# Altium schematic sheet main.SchDoc (part 1 of 2)
size A4
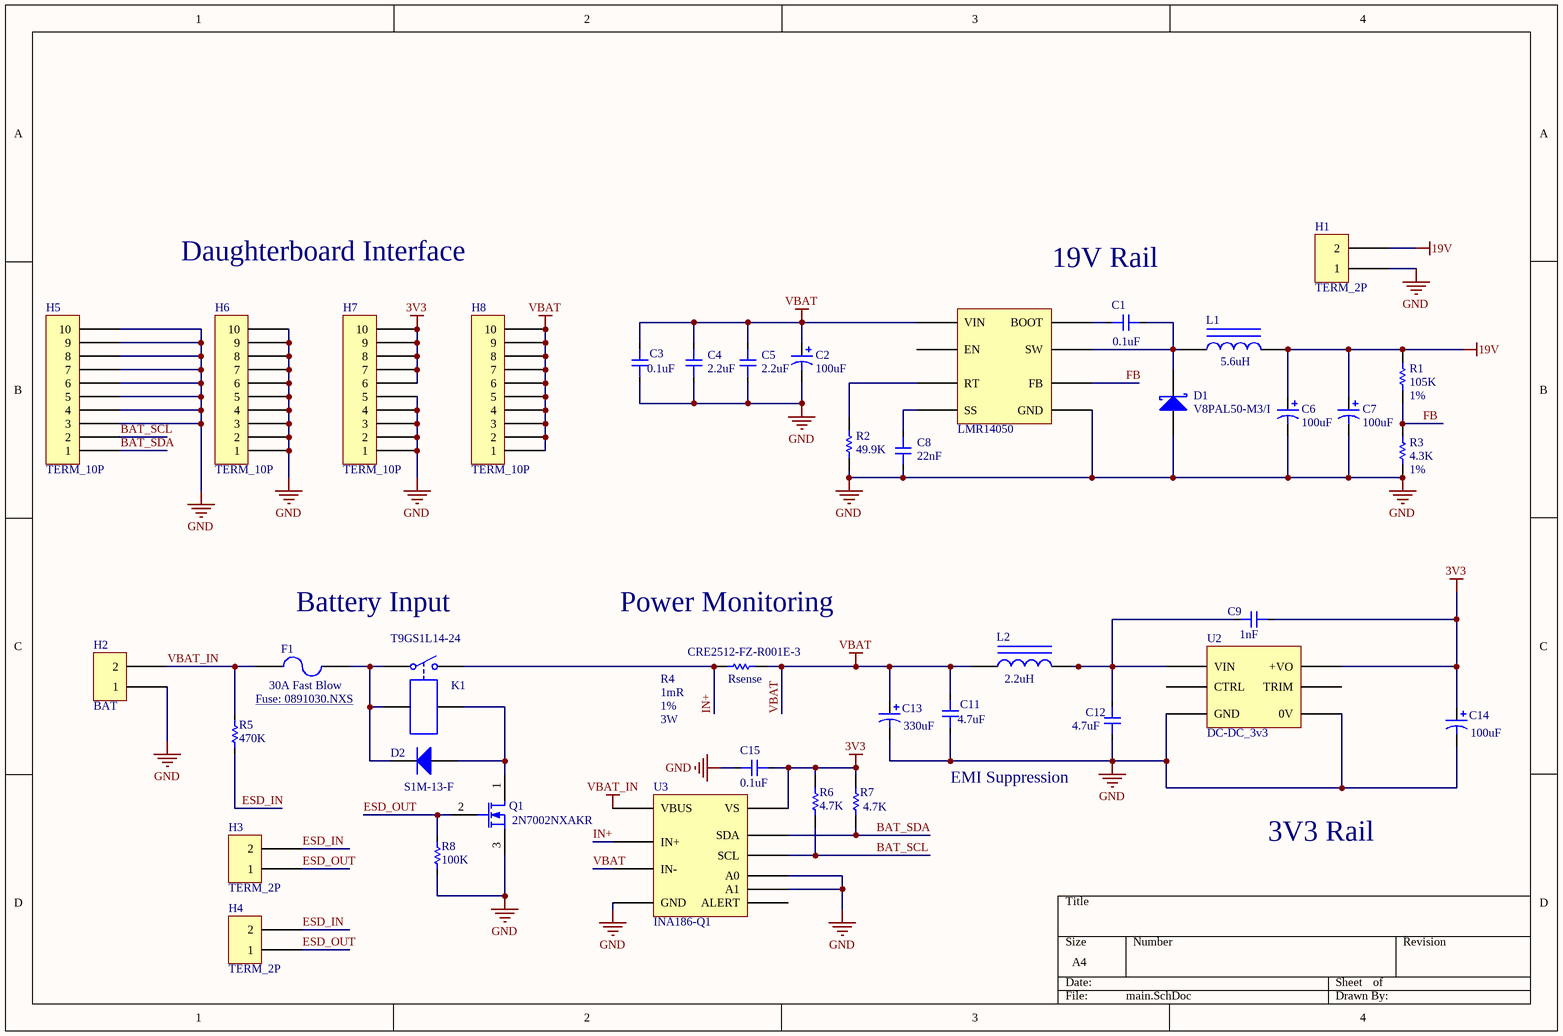
[diagram p0: main.SchDoc]

## Parts
?  LMR14050  [HSOIC-8]
C1  Capacitance: 0.1uF  [CAP 0805 L]  (hidden comment: value)
C2  Capacitance: 100uF  [CAP_ALEY_D8]  (hidden comment: Cap Pol1)
C3  Capacitance: 0.1uF  [1206_CAP]  (hidden comment: value)
C4  value 2.2uF  [1210]  (hidden comment: value)
C5  value 2.2uF  [1210]  (hidden comment: value)
C6  Capacitance: 100uF  [CAP_THRU]  (hidden comment: Cap Pol1)
C7  Capacitance: 100uF  [CAP_THRU]  (hidden comment: Cap Pol1)
C8  value 22nF  [CAP 0805 L]  (hidden comment: value)
C9  value 1nF  [CAP 0805 L]  (hidden comment: value)
C11  value 4.7uF  [1206_CAP]  (hidden comment: value)
C12  value 4.7uF  [1206_CAP]  (hidden comment: value)
C13  Capacitance: 330uF  [CAP_ALELY_h13]  (hidden comment: Cap Pol1)
C14  Capacitance: 100uF  [CAP_ALEY_D8]  (hidden comment: Cap Pol1)
C15  0.1uF  [CAP 0805 L]
D1  Manufacturer Part Number: V8PAL50-M3/I  [DO-221BC]  (hidden comment: D Schottky)
D2  Manufacturer Part Number: S1M-13-F  [DIOM5226X240N]  (hidden comment: Diode)
F1  30A Fast Blow  [FUSE_HOLDER_30A]
H1  TERM_2P  [MOLEX_3MM_2]
H2  BAT  [PP45_VERT]
H3  TERM_2P  [MOLEX_3MM_2]
H4  TERM_2P  [MOLEX_3MM_2]
H5  TERM_10P  [HEADER_10P]
H6  TERM_10P  [HEADER_10P]
H7  TERM_10P  [HEADER_10P]
H8  TERM_10P  [HEADER_10P]
K1  Manufacturer Part Number: T9GS1L14-24  [RELAY_30A]  (hidden comment: Relay-SPST)
L1  Inductance: 5.6uH  [IND_SMT]  (hidden comment: Inductor Iron)
L2  value 2.2uH  [IND_SMT_s]  (hidden comment: Inductor Iron)
Q1  Manufacturer Part Number: 2N7002NXAKR  [SOT23-3]  (hidden comment: MOSFET-N)
R1  Resistance: 105K  Tolerance: 1%  [RES 0603 L]  (hidden comment: Res1)
R2  value 49.9K  [RES 0603 L]  (hidden comment: Res1)
R3  Resistance: 4.3K  Tolerance: 1%  [RES 0603 L]  (hidden comment: Res1)
R4  Rsense  Manufacturer Part Number: CRE2512-FZ-R001E-3  Resistance: 1mR  Power Rating: 3W  Tolerance: 1%  [RSENSE]
R5  470K  [RES 0603 L]
R6  value 4.7K  [RES 0603 L]  (hidden comment: Res1)
R7  value 4.7K  [RES 0603 L]  (hidden comment: Res1)
R8  100K  [RES 0603 L]
U2  DC-DC_3v3  [DC_3V3]
U3  INA186-Q1  [VSSOP-10]

## Nets
3V3: C9.1 C14.1 C15.2 H7.6 H7.7 H7.8 H7.9 H7.10 R6.1 R7.2 U2.4(+VO) U3.6(VS)
19V: C6.1 C7.1 H1.2 L1.2 R1.2
GND: ?.7(GND) C2.2 C3.2 C4.1 C5.1 C6.2 C7.2 C8.1 C11.1 C12.1 C13.2 C14.2 C15.1 D1.1(A) H1.1 H2.1 H5.3 H5.4 H5.5 H5.6 H5.7 H5.8 H5.9 H5.10 H6.1 H6.2 H6.3 H6.4 H6.5 H6.6 H6.7 H6.8 H6.9 H6.10 H7.1 H7.2 H7.3 H7.4 H7.5 Q1.3(S) R2.1 R3.1 R8.1 U2.2(GND) U2.6(0V) U3.1(A1) U3.2(A0) U3.7(GND)
VBAT: ?.2(VIN) C2.1 C3.1 C4.2 C5.2 C11.2 C13.1 H8.1 H8.2 H8.3 H8.4 H8.5 H8.6 H8.7 H8.8 H8.9 H8.10 L2.1 R4.1 U3.9(IN-)
VBAT_IN: F1.1 H2.2 R5.2 U3.8(VBUS)
BAT_SCL: H5.2 R6.2 U3.5(SCL)
BAT_SDA: H5.1 R7.1 U3.4(SDA)
ESD_IN: H3.2 H4.2 R5.1
ESD_OUT: H3.1 H4.1 Q1.2(G) R8.2
FB: ?.5(FB) R1.1 R3.2
IN+: K1.2 R4.2 U3.10(IN+)
Net?_1: ?.1(BOOT) C1.2
Net?_4: ?.4(RT) R2.2
Net?_6: ?.6(SS) C8.2
Net?_8: ?.8(SW) C1.1 D1.2(K) L1.1
NetC9_2: C9.2 C12.2 L2.2 U2.3(VIN)
NetD2_1: D2.1(A) K1.4 Q1.1(D)
NetD2_2: D2.2(C) F1.2 K1.1 K1.3

Not connected (* = marked no-connect by the designer): ? 3(EN); U2 1(CTRL) 5(TRIM); U3 3(ALERT)

## Notes on the sheet
- Daughterboard Interface
- (near C1) 19V Rail
- Battery Input
- (near R4) Power Monitoring
- Fuse: 0891030.NXS <https://www.digikey.ca/en/products/detail/littelfuse-inc/0891030-NXS/2046671?_ga=2.119971018.373279892.1593273465-1674686556.1586828535>
- EMI Suppression
- 3V3 Rail